# Altium schematic sheet 8-DRV_LDO_6V.SchDoc: DRV LDO 6V
size A4; CompanyName: e-TESC LAB; Organization: Sherbrooke's University; Address1: Genie / GEGI; Address2: 2500 boulevard de l'universite; Address3: J1K2R SHERBROOKE; Address4: QUEBEC, CANADA; DocumentNumber: 3; SheetNumber: 3; SheetTotal: 7
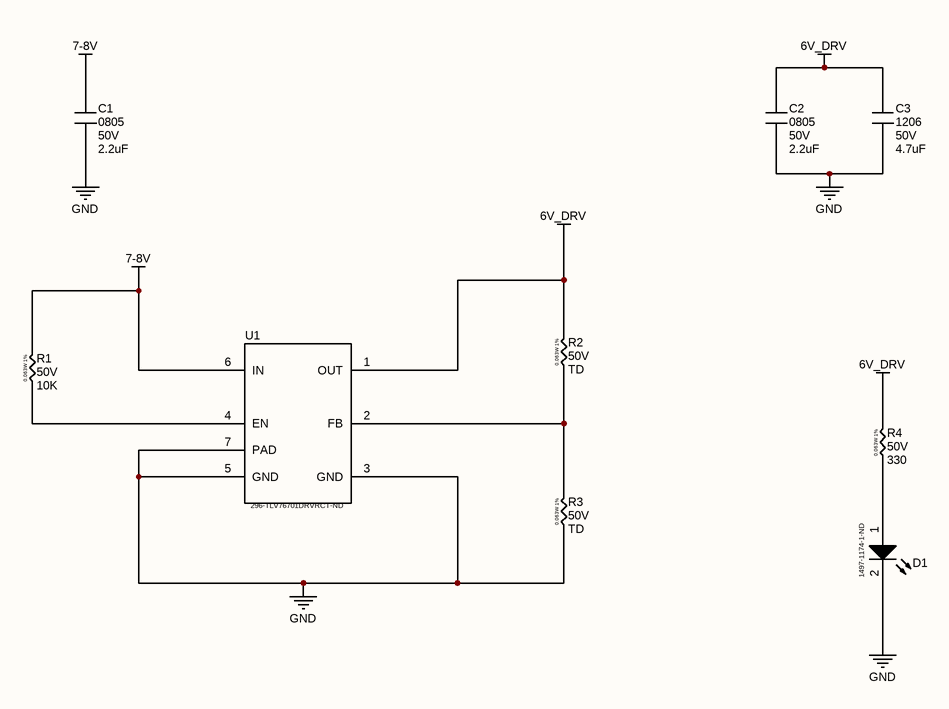
[diagram p0: 8-DRV_LDO_6V.SchDoc]

## Parts
C1  Package: 0805  VDC: 50V  [C 0805(2012)x0.65]  (hidden comment: 2.2uF)
C2  Package: 0805  VDC: 50V  [C 0805(2012)x0.65]  (hidden comment: 2.2uF)
C3  Package: 1206  VDC: 50V  [C 1206(3216)x1.6]  (hidden comment: 4.7uF)
D1  Supplier Part Number 1: 1497-1174-1-ND  [LED 0402]  (hidden comment: 0402)
R1  VDC: 50V  [R 0402(1005)-1%]  (hidden comment: 10K)
R2  VDC: 50V  [R 0402(1005)-1%]  (hidden comment: TD)
R3  VDC: 50V  [R 0402(1005)-1%]  (hidden comment: TD)
R4  VDC: 50V  [R 0402(1005)-1%]  (hidden comment: 330)
U1  Supplier Part Number 1: 296-TLV76701DRVRCT-ND  [WSON-6_0.65_EP]  (hidden comment: WSON6_EP)

## Nets
6V_DRV: C2.1 C3.1 R2.2 R4.2 U1.1(OUT)
7-8V: C1.1 R1.2 U1.6(IN)
GND: C1.2 C2.2 C3.2 D1.2 R3.1 U1.3(GND) U1.5(GND) U1.7(PAD)
NetD1_1: D1.1 R4.1
NetR1_1: R1.1 U1.4(EN)
NetR2_1: R2.1 R3.2 U1.2(FB)

## Notes on the sheet
- Title:
- Size:
- Date:
- A
- Revision:
- Time:
- Author:
- Sheet
- of
- File:
- (in symbol RES 0402-1%) 0.063W 1%

## Library data of the parts
C1 C2 = CAP 0805 2.2nF 50V X7R: SMD-0805 50V X7R 10%; Part Number: CL21B222KBNC; Manufacturer: Samsung; TYPE: Capacitors; Package-mm: 2012; Mount Type: SMT; Publisher: Hefest; Manufacturer Alternate: *; Part Number Alternate: *; Published: 07.04.2019; Supplier 1: Comet; Supplier 2: *; Supplier 3: *; Supplier Part Number 1: C0805 2.2nF 50V X7R SAMSUNG; Supplier Part Number 2: *; Supplier Part Number 3: *; RoHS: Y; Technology: Ceramic  MLCC; Value 1: *; Value 2: *; TempCo: X7R; Tolerance %: ±10%; VAC: *; ESR Ohm: *; ComponentLink1Description: Datasheet link; ComponentLink1URL: https://store.comet.bg/download-file.php?id=11; Temperature Range: -55°C ~ +125°C; Price: 0.026; Value: 2.2uF
C3 = CAP 1206 4.7uF 50V X7R: SMD-1206 50V X7R 10%; Part Number: CL31B475KBHNNNE; Manufacturer: Samsung; TYPE: Capacitors; Package-mm: 3216; Mount Type: SMT; Publisher: Hefest; Manufacturer Alternate: *; Part Number Alternate: *; Published: 07.04.2019; Supplier 1: Comet; Supplier 2: *; Supplier 3: *; Supplier Part Number 1: C1206 4.7uF 50V X7R SAMSUNG; Supplier Part Number 2: *; Supplier Part Number 3: *; RoHS: Y; Technology: Ceramic  MLCC; Value 1: *; Value 2: *; TempCo: X7R; Tolerance %: ±10%; VAC: *; ESR Ohm: *; ComponentLink1Description: Datasheet link; ComponentLink1URL: https://store.comet.bg/download-file.php?id=11; Temperature Range: -55°C ~ +125°C; Price: 0.290; Value: 4.7uF
D1 = LED 0402: LED SMD 0402; Supplier 1: Digi-Key; PACKAGE: 0402; TYPE: LED
R1-R4 = RES 0402-1%: SMD 0402 0.063W 1% 50V; Manufacturer: YAGEO; TempCo: ±100ppm/°C; Package-mm: 1005; Value Code: 1001; Power: 0.0625W; Part Number: *; Mount Type: SMT; Publisher: Hefest; Manufacturer Alternate: *; Published: 07.04.2019; Supplier 1: Comet; Supplier 2: *; Supplier 3: *; Supplier Part Number 1: R0402 1.0K 1% YAG/ASJ; Supplier Part Number 2: *; Supplier Part Number 3: *; RoHS: Y; Technology: Thick film; Value 2: *; Package: 0402; Tolerance %: ±1%; ComponentLink1Description: Datasheet link; ComponentLink1URL: https://store.comet.bg/download-file.php?id=1224; Temperature Range: -55°C ~ +155°C; Price: 0.015; Part Number Alternate: *; TYPE: Resistor; Value 1: *
  R1: Value: 10K
  R2 R3: Value: TD
  R4: Value: 330
U1 = TLV76701: LDO ADJ; Supplier 1: Digi-Key